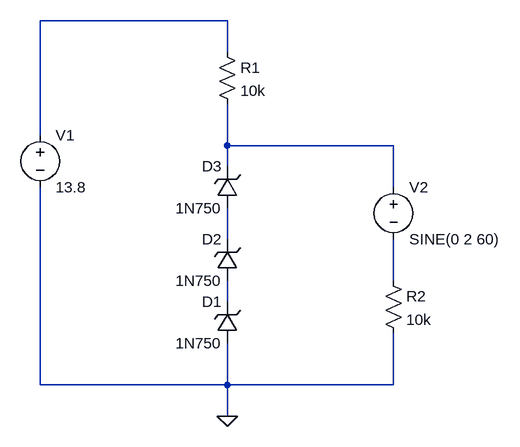
[diagram p0: schematic Draft13.asc]
Draft13.asc, the LTspice schematic file:
Version 4
SHEET 1 880 680
WIRE 160 -464 -128 -464
WIRE 160 -416 160 -464
WIRE -128 -288 -128 -464
WIRE 160 -272 160 -336
WIRE 416 -272 160 -272
WIRE 160 -240 160 -272
WIRE 416 -208 416 -272
WIRE 160 -128 160 -176
WIRE 416 -64 416 -128
WIRE 160 -32 160 -64
WIRE -128 96 -128 -208
WIRE 160 96 160 32
WIRE 160 96 -128 96
WIRE 416 96 416 16
WIRE 416 96 160 96
WIRE 160 144 160 96
FLAG 160 144 0
SYMBOL zener 176 32 R180
WINDOW 0 24 64 Left 2
WINDOW 3 24 0 Left 2
SYMATTR InstName D1
SYMATTR Value 1N750
SYMBOL zener 176 -64 R180
WINDOW 0 24 64 Left 2
WINDOW 3 24 0 Left 2
SYMATTR InstName D2
SYMATTR Value 1N750
SYMBOL zener 176 -176 R180
WINDOW 0 24 64 Left 2
WINDOW 3 24 0 Left 2
SYMATTR InstName D3
SYMATTR Value 1N750
SYMBOL res 144 -432 R0
SYMATTR InstName R1
SYMATTR Value 10k
SYMBOL voltage -128 -304 R0
WINDOW 123 0 0 Left 0
WINDOW 39 0 0 Left 0
SYMATTR InstName V1
SYMATTR Value 13.8
SYMBOL res 400 -80 R0
SYMATTR InstName R2
SYMATTR Value 10k
SYMBOL voltage 416 -224 R0
WINDOW 123 0 0 Left 0
WINDOW 39 0 0 Left 0
SYMATTR InstName V2
SYMATTR Value SINE(0 2 60)

The netlist it stands for:
* Draft13.asc
D1 0 N005 1N750
D2 N005 N003 1N750
D3 N003 N002 1N750
R1 N001 N002 10k
V1 N001 0 13.8
R2 N004 0 10k
V2 N002 N004 SINE(0 2 60)
.model D D
.lib standard.dio
.backanno
.end